# Altium schematic sheet AMPLIFIER.SchDoc
size B; SheetNumber: 4; SheetTotal: 4
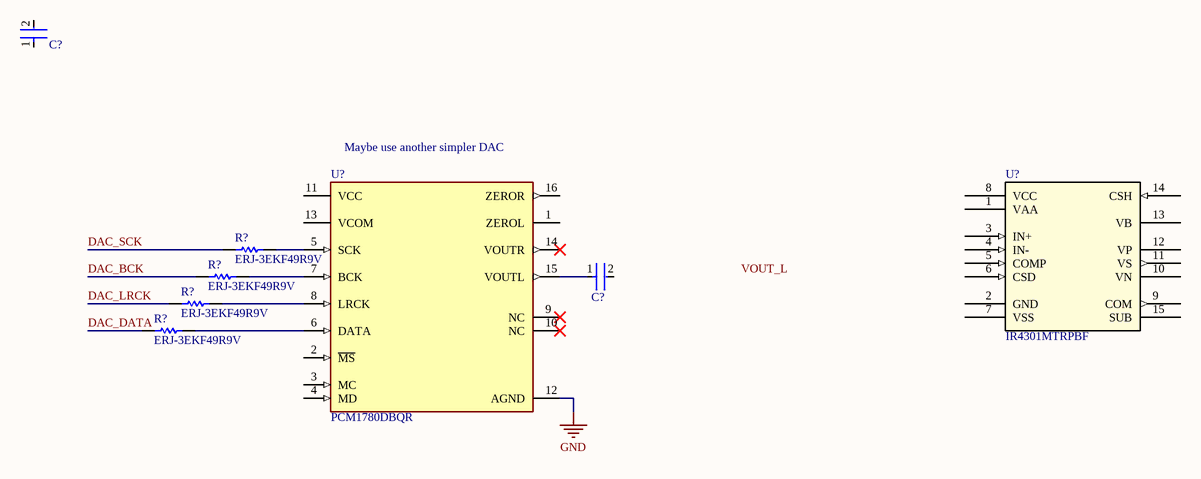
[diagram p0: AMPLIFIER.SchDoc]

## Parts
(Parts that share a designator on the sheet are numbered #1, #2 ... from top to bottom, then left to right.)
C?#1  GRM188R60J106ME47D  [FP-GRM188-0_1-e0_2_0_55-IPC_A]  (value not drawn)
C?#2  GRM188R60J106ME47D  [FP-GRM188-0_1-e0_2_0_55-IPC_A]  (value not drawn)
R?#1  ERJ-3EKF49R9V  [RESC1608X55X30ML15T15]
R?#2  ERJ-3EKF49R9V  [RESC1608X55X30ML15T15]
R?#3  ERJ-3EKF49R9V  [RESC1608X55X30ML15T15]
R?#4  ERJ-3EKF49R9V  [RESC1608X55X30ML15T15]
U?#1  PCM1780DBQR  [FP-DBQ0016A-IPC_C]
U?#2  IR4301MTRPBF  [IR4301MTRPBF-Footprint-1]

## Nets
GND: U?#1.12(AGND)
DAC_BCK: R?#2.2
DAC_DATA: R?#4.2
DAC_LRCK: R?#3.2
DAC_SCK: R?#1.2
NetC?#2_1: C?#2.1 U?#1.15(VOUTL)
NetR?#1_1: R?#1.1 U?#1.5(SCK)
NetR?#2_1: R?#2.1 U?#1.7(BCK)
NetR?#3_1: R?#3.1 U?#1.8(LRCK)
NetR?#4_1: R?#4.1 U?#1.6(DATA)

Not connected (* = marked no-connect by the designer): C?#1 1 2; C?#2 2; U?#1 1(ZEROL) 2(~{MS}) 3(MC) 4(MD) 9(NC)* 10(NC)* 11(VCC) 13(VCOM) 14(VOUTR)* 16(ZEROR); U?#2 1(VAA) 2(GND) 3(IN+) 4(IN-) 5(COMP) 6(CSD) 7(VSS) 8(VCC) 9(COM) 10(VN) 11(VS) 12(VP) 13(VB) 14(CSH) 15(SUB)

## Notes on the sheet
- (near U?#1) Maybe use another simpler DAC
- Labels drawn without touching a wire or pin: VOUT_L

## Library data of the parts
C?#1 C?#2 = CMP-2006-02792-2: Chip Multilayer Ceramic Capacitors for General Purpose, 0603, 10uF, X5R, 15%, 20%, 6.3V; Packaging: Tape and Reel; Voltage Rating (DC): 6.3V; Width: 0.031inch; Termination: SMD/SMT; Dielectric: X5R; Package Quantity: 4000; Voltage Rating: 6.3V; Capacitance: 10uF; Case/Package: 0603; Min Operating Temperature: -55°C; Voltage: 6.3V; Length: 1.6mm; Thickness: 0.035inch; Lead Free: Lead Free; Depth: 0.8mm; Case Code (Imperial): 0603; Max Operating Temperature: 85°C; Material: Ceramic; Height: 0.8mm; Tolerance: 20%; Mount: Surface Mount; REACH SVHC: No SVHC; Radiation Hardening: No; Case Code (Metric): 1608
R?#1-R?#4 = CMP-2000-00538-1: Manufacturer: Panasonic; Part Number: ERJ-3EKF49R9V
U?#1 = CMP-04861-000034-1: IC DAC/AUDIO 24BIT 200K 16SSOP; Number of Channels: 2; Operating Supply Voltage: 5V; Conversion Rate: 192KS/s; Number of Analog Inputs: 0; Number of Bits: 24; Max Supply Voltage: 5.5V; Min Supply Voltage: 4.5V; Signal to Noise Ratio (SNR): 106dB; Max Power Dissipation: 200mW; Resolution: 24b; Interface: Serial; Output Type: Voltage; Sampling Rate: 200000S/s; Supply Type: Single; Power Consumption: 80mW; Nominal Supply Current: 30mA; Radiation Hardening: No; Number of Pins: 16; Packaging: Tape and Reel; Lead Free: Lead Free; Min Operating Temperature: -25°C; Number of Analog Outputs: 2; Weight: 0.002469oz; Package Quantity: 2000; Series: -; Number of Converters: 2; Case/Package: SSOP; Number of DAC Channels: 2; RoHS Compliant: Yes; Max Operating Temperature: 85°C; Mount: Surface Mount
U?#2 = CMP-014-00006-1: IR4301 Series 15 V Integrated Analog Input Class D Audio Amplifier - PQFN-22